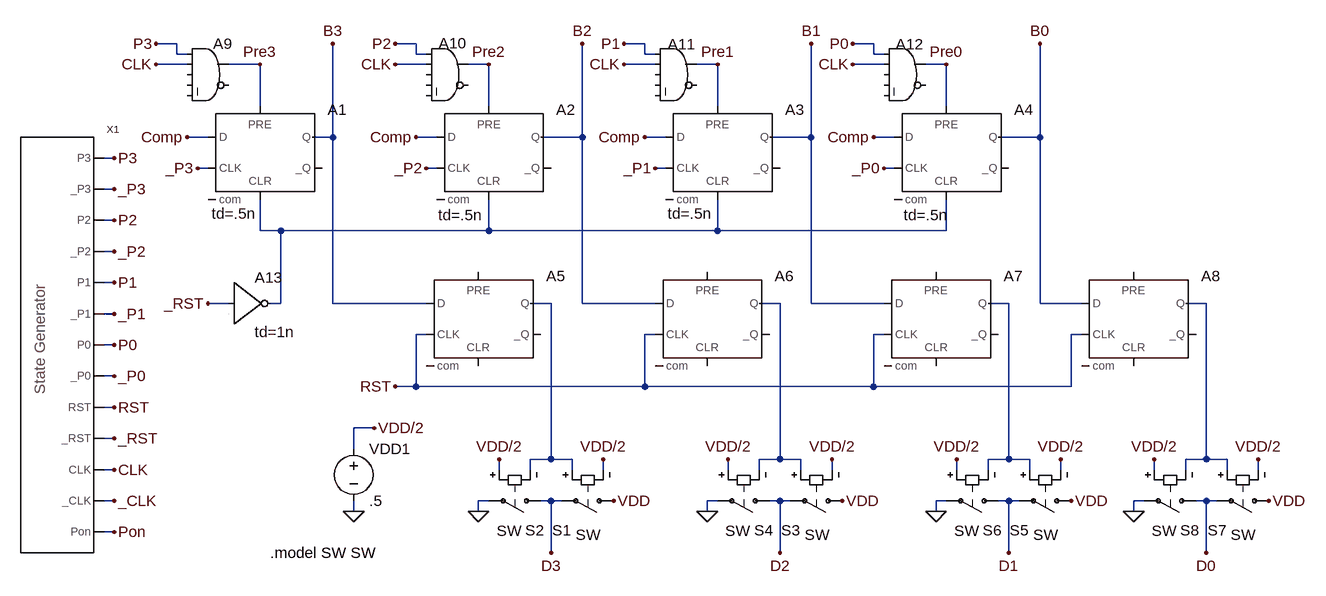
[diagram p0: schematic SuccessiveApproximationRegister.asc]
SuccessiveApproximationRegister.asc, the LTspice schematic file:
Version 4
SHEET 1 1744 1132
WIRE -16 32 -48 32
WIRE 352 32 320 32
WIRE 704 32 672 32
WIRE 1056 32 1024 32
WIRE -16 48 -16 32
WIRE 0 48 -16 48
WIRE 352 48 352 32
WIRE 368 48 352 48
WIRE 704 48 704 32
WIRE 720 48 704 48
WIRE 1056 48 1056 32
WIRE 1072 48 1056 48
WIRE 0 64 -48 64
WIRE 112 64 64 64
WIRE 368 64 320 64
WIRE 464 64 432 64
WIRE 720 64 672 64
WIRE 816 64 784 64
WIRE 1072 64 1024 64
WIRE 1168 64 1136 64
WIRE 112 128 112 64
WIRE 464 128 464 64
WIRE 816 128 816 64
WIRE 1168 128 1168 64
WIRE 32 176 0 176
WIRE 224 176 224 32
WIRE 224 176 192 176
WIRE 384 176 352 176
WIRE 608 176 608 32
WIRE 608 176 544 176
WIRE 736 176 704 176
WIRE 960 176 960 32
WIRE 960 176 896 176
WIRE 1088 176 1056 176
WIRE 1312 176 1312 32
WIRE 1312 176 1248 176
WIRE -112 208 -128 208
WIRE 32 224 16 224
WIRE 384 224 368 224
WIRE 736 224 720 224
WIRE 1088 224 1072 224
WIRE -112 256 -128 256
WIRE -112 304 -128 304
WIRE 112 320 112 272
WIRE 144 320 112 320
WIRE 464 320 464 272
WIRE 464 320 144 320
WIRE 816 320 816 272
WIRE 816 320 464 320
WIRE 1168 320 1168 272
WIRE 1168 320 816 320
WIRE -112 352 -128 352
WIRE -112 400 -128 400
WIRE 64 432 32 432
WIRE 144 432 144 320
WIRE 144 432 128 432
WIRE 224 432 224 176
WIRE 368 432 224 432
WIRE 560 432 528 432
WIRE 608 432 608 176
WIRE 720 432 608 432
WIRE 912 432 880 432
WIRE 960 432 960 176
WIRE 1072 432 960 432
WIRE 1264 432 1232 432
WIRE 1312 432 1312 176
WIRE 1376 432 1312 432
WIRE 1568 432 1536 432
WIRE -112 448 -128 448
WIRE 368 480 352 480
WIRE 720 480 704 480
WIRE 1072 480 1056 480
WIRE 1376 480 1360 480
WIRE -112 496 -128 496
WIRE -112 544 -128 544
WIRE 352 560 352 480
WIRE 352 560 320 560
WIRE 704 560 704 480
WIRE 704 560 352 560
WIRE 1056 560 1056 480
WIRE 1056 560 704 560
WIRE 1360 560 1360 480
WIRE 1360 560 1056 560
WIRE -112 592 -128 592
WIRE 288 624 256 624
WIRE -112 640 -128 640
WIRE 256 656 256 624
WIRE 560 672 560 432
WIRE 560 672 528 672
WIRE 592 672 560 672
WIRE 912 672 912 432
WIRE 912 672 880 672
WIRE 944 672 912 672
WIRE 1264 672 1264 432
WIRE 1264 672 1232 672
WIRE 1296 672 1264 672
WIRE 1568 672 1568 432
WIRE 1568 672 1536 672
WIRE 1600 672 1568 672
WIRE -112 688 -128 688
WIRE 480 688 480 672
WIRE 528 688 528 672
WIRE 592 688 592 672
WIRE 640 688 640 672
WIRE 832 688 832 672
WIRE 880 688 880 672
WIRE 944 688 944 672
WIRE 992 688 992 672
WIRE 1184 688 1184 672
WIRE 1232 688 1232 672
WIRE 1296 688 1296 672
WIRE 1344 688 1344 672
WIRE 1488 688 1488 672
WIRE 1536 688 1536 672
WIRE 1600 688 1600 672
WIRE 1648 688 1648 672
WIRE -112 736 -128 736
WIRE 464 736 448 736
WIRE 560 736 544 736
WIRE 576 736 560 736
WIRE 816 736 800 736
WIRE 912 736 896 736
WIRE 928 736 912 736
WIRE 1168 736 1152 736
WIRE 1264 736 1248 736
WIRE 1280 736 1264 736
WIRE 1472 736 1456 736
WIRE 1568 736 1552 736
WIRE 1584 736 1568 736
WIRE 256 752 256 736
WIRE 448 752 448 736
WIRE 800 752 800 736
WIRE 1152 752 1152 736
WIRE 1456 752 1456 736
WIRE -112 784 -128 784
WIRE 560 816 560 736
WIRE 912 816 912 736
WIRE 1264 816 1264 736
WIRE 1568 816 1568 736
FLAG -112 208 P3
FLAG -112 304 P2
FLAG -112 400 P1
FLAG -112 496 P0
FLAG -112 256 _P3
FLAG -112 352 _P2
FLAG -112 448 _P1
FLAG -112 544 _P0
FLAG -112 592 RST
FLAG -112 640 _RST
FLAG -112 688 CLK
FLAG -112 736 _CLK
FLAG -112 784 Pon
FLAG 1024 32 P0
FLAG 672 32 P1
FLAG 320 32 P2
FLAG -48 32 P3
FLAG 320 560 RST
FLAG 32 432 _RST
FLAG 0 176 Comp
FLAG 352 176 Comp
FLAG 704 176 Comp
FLAG 1056 176 Comp
FLAG -48 64 CLK
FLAG 320 64 CLK
FLAG 672 64 CLK
FLAG 1024 64 CLK
FLAG 1072 224 _P0
FLAG 720 224 _P1
FLAG 368 224 _P2
FLAG 16 224 _P3
FLAG 1312 32 B0
FLAG 960 32 B1
FLAG 608 32 B2
FLAG 224 32 B3
FLAG 1568 816 D0
FLAG 1264 816 D1
FLAG 912 816 D2
FLAG 560 816 D3
FLAG 1168 64 Pre0
FLAG 816 64 Pre1
FLAG 464 64 Pre2
FLAG 112 64 Pre3
FLAG 448 752 0
FLAG 656 736 VDD
FLAG 640 672 VDD/2
FLAG 480 672 VDD/2
FLAG 800 752 0
FLAG 1008 736 VDD
FLAG 992 672 VDD/2
FLAG 832 672 VDD/2
FLAG 1152 752 0
FLAG 1360 736 VDD
FLAG 1344 672 VDD/2
FLAG 1184 672 VDD/2
FLAG 1456 752 0
FLAG 1664 736 VDD
FLAG 1648 672 VDD/2
FLAG 1488 672 VDD/2
FLAG 256 752 0
FLAG 288 624 VDD/2
SYMBOL Digital\\dflop 112 128 R0
WINDOW 3 -74 166 Left 0
SYMATTR Value td=.5n
SYMATTR InstName A1
SYMBOL Digital\\dflop 464 128 R0
WINDOW 3 -78 168 Left 0
SYMATTR Value td=.5n
SYMATTR InstName A2
SYMBOL Digital\\dflop 816 128 R0
WINDOW 3 -77 166 Left 0
SYMATTR Value td=.5n
SYMATTR InstName A3
SYMBOL Digital\\dflop 448 384 R0
SYMATTR InstName A5
SYMBOL Digital\\dflop 800 384 R0
SYMATTR InstName A6
SYMBOL Digital\\dflop 1152 384 R0
SYMATTR InstName A7
SYMBOL Digital\\dflop 1456 384 R0
SYMATTR InstName A8
SYMBOL StateGen -256 672 R0
SYMATTR InstName X1
SYMBOL Digital\\and 32 16 R0
SYMATTR InstName A9
SYMBOL Digital\\and 400 16 R0
WINDOW 0 -13 15 Left 0
SYMATTR InstName A10
SYMBOL Digital\\and 752 16 R0
WINDOW 0 -13 17 Left 0
SYMATTR InstName A11
SYMBOL Digital\\and 1104 16 R0
WINDOW 0 -14 17 Left 0
SYMATTR InstName A12
SYMBOL Digital\\inv 64 368 R0
SYMATTR InstName A13
SYMATTR Value td=1n
SYMBOL sw 672 736 R90
WINDOW 0 45 81 VRight 0
WINDOW 3 52 36 VRight 0
SYMATTR InstName S1
SYMBOL sw 560 736 R90
WINDOW 0 45 40 VLeft 0
WINDOW 3 46 84 VLeft 0
SYMATTR InstName S2
SYMBOL sw 1024 736 R90
WINDOW 0 45 81 VRight 0
WINDOW 3 52 36 VRight 0
SYMATTR InstName S3
SYMBOL sw 912 736 R90
WINDOW 0 45 40 VLeft 0
WINDOW 3 46 84 VLeft 0
SYMATTR InstName S4
SYMBOL sw 1376 736 R90
WINDOW 0 45 81 VRight 0
WINDOW 3 52 36 VRight 0
SYMATTR InstName S5
SYMBOL sw 1264 736 R90
WINDOW 0 45 40 VLeft 0
WINDOW 3 46 84 VLeft 0
SYMATTR InstName S6
SYMBOL sw 1680 736 R90
WINDOW 0 45 81 VRight 0
WINDOW 3 52 36 VRight 0
SYMATTR InstName S7
SYMBOL sw 1568 736 R90
WINDOW 0 45 40 VLeft 0
WINDOW 3 46 84 VLeft 0
SYMATTR InstName S8
SYMBOL voltage 256 640 R0
WINDOW 123 0 0 Left 0
WINDOW 39 0 0 Left 0
SYMATTR InstName VDD1
SYMATTR Value .5
SYMBOL Digital\\dflop 1168 128 R0
WINDOW 3 -66 168 Left 0
SYMATTR Value td=.5n
SYMATTR InstName A4
TEXT 128 816 Left 0 !.model SW SW

The netlist it stands for:
* SuccessiveApproximationRegister.asc
A1 Comp 0 _P3 Pre3 N001 0 B3 0 DFLOP td=.5n
A2 Comp 0 _P2 Pre2 N001 0 B2 0 DFLOP td=.5n
A3 Comp 0 _P1 Pre1 N001 0 B1 0 DFLOP td=.5n
A5 B3 0 RST 0 0 0 N002 0 DFLOP
A6 B2 0 RST 0 0 0 N003 0 DFLOP
A7 B1 0 RST 0 0 0 N004 0 DFLOP
A8 B0 0 RST 0 0 0 N005 0 DFLOP
XX1 RST P0 P1 P2 P3 CLK _CLK _RST _P0 _P1 _P2 _P3 Pon StateGen  ; pins RST P0 P1 P2 P3 CLK _CLK _RST _P0 _P1 _P2 _P3 Pon
A9 P3 CLK 0 0 0 0 Pre3 0 AND
A10 P2 CLK 0 0 0 0 Pre2 0 AND
A11 P1 CLK 0 0 0 0 Pre1 0 AND
A12 P0 CLK 0 0 0 0 Pre0 0 AND
A13 _RST 0 0 0 0 N001 0 0 BUF td=1n
S1 VDD D3 N002 VDD/2 SW
S2 D3 0 VDD/2 N002 SW
S3 VDD D2 N003 VDD/2 SW
S4 D2 0 VDD/2 N003 SW
S5 VDD D1 N004 VDD/2 SW
S6 D1 0 VDD/2 N004 SW
S7 VDD D0 N005 VDD/2 SW
S8 D0 0 VDD/2 N005 SW
VDD1 VDD/2 0 .5
A4 Comp 0 _P0 Pre0 N001 0 B0 0 DFLOP td=.5n
.model SW SW
.backanno
.end